# EAGLE design NMEA-v8.3-iso (EAGLE 6.4)
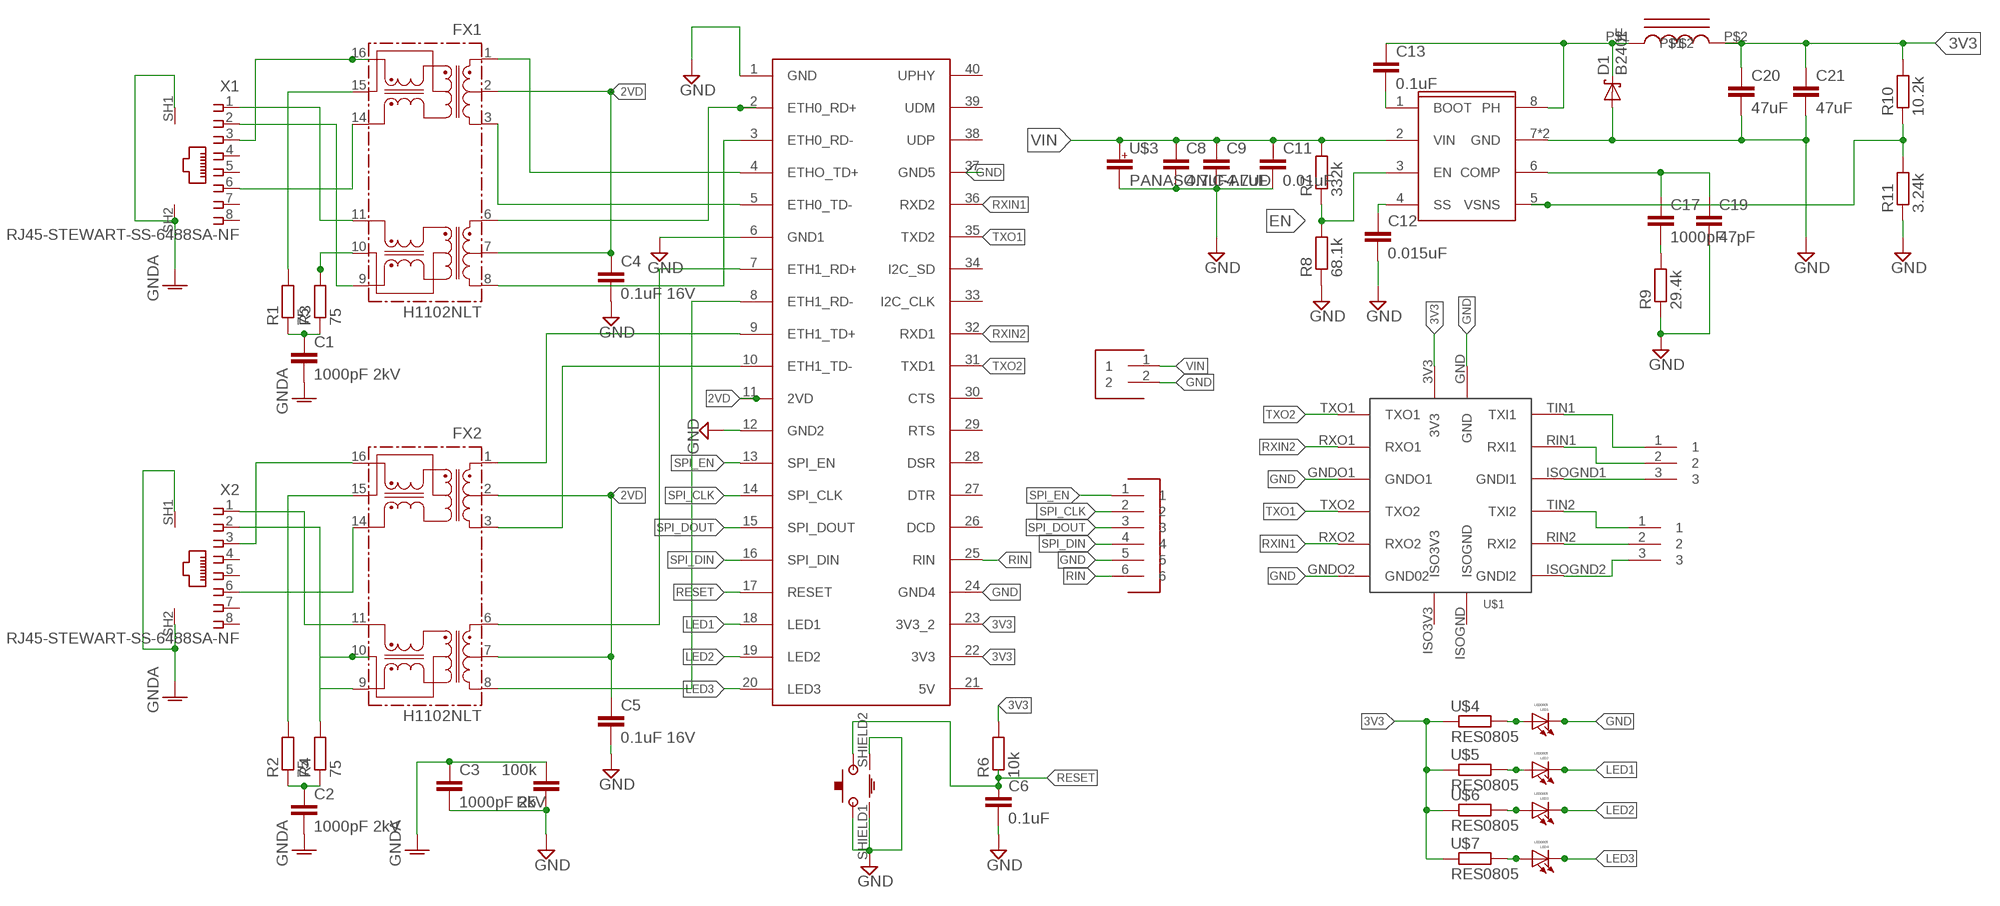
[diagram p0: schematic, sheet 1]

## Parts
C1  1000pF 2kV  CAP1206  [1206]
C2  1000pF 2kV  CAP1206  [1206]
C3  1000pF 2kV  CAP1206  [1206]
C4  0.1uF 16V  CAP0603  [0603]
C5  0.1uF 16V  CAP0603  [0603]
C6  0.1uF  CAP0603  [0603]
C8  4.7uF  CAP1210  [1210]
C9  4.7uF  CAP1210  [1210]
C11  0.01uF  CAP0603  [0603]
C12  0.015uF  CAP0603  [0603]
C13  0.1uF  CAP0603  [0603]
C17  1000pF  CAP0603  [0603]
C19  47pF  CAP0603  [0603]
C20  47uF  CAP1206  [1206]
C21  47uF  CAP1206  [1206]
CARAMBOLA  CARAMBOLACREAM  [CARAMBOLA-CREAM]
D1  B240F  [SMB]
DATA1  CON-3CREAM  [CON-3-CREAM]
DATA2  CON-3CREAM  [CON-3-CREAM]
FX1  H1102NLT  [H/HX1XXXNL]
FX2  H1102NLT  [H/HX1XXXNL]
J1  CON-5MM-2  [CON--5MM-2]
L1  CLF_TDK_INDUCTORCLF10040  [CLF10040]
LED1  LED0805  [L0805]
LED2  LED0805  [L0805]
LED3  LED0805  [L0805]
LED4  LED0805  [L0805]
R1  75  RES0603  [0603]
R2  75  RES0603  [0603]
R3  75  RES0603  [0603]
R4  75  RES0603  [0603]
R5  100k  CAP1206  [1206]
R6  10k  RES0603  [0603]
R7  332k  RES0603  [0603]
R8  68.1k  RES0603  [0603]
R9  29.4k  RES0603  [0603]
R10  10.2k  RES0603  [0603]
R11  3.24k  RES0603  [0603]
U8  TPS54231  [SOIC-THERMAL]
U$1  ISO-BOARDV1  [ISO-BOARD]
U$2  TACTILE-SWITCH-FSMRA1J  [TACTILE-SWITCH-FSMRA1J]
U$3  PANASONIC-ALUD  [PANASONIC_D]
U$4  RES0805  RES0603  [0603]
U$5  RES0805  RES0603  [0603]
U$6  RES0805  RES0603  [0603]
U$7  RES0805  RES0603  [0603]
U$8  CON-6  [CON-6]
X1  RJ45-STEWART-SS-6488SA-NF  [RJ45-STEWART-6488]
X2  RJ45-STEWART-SS-6488SA-NF  [RJ45-STEWART-6488]

## Nets
2VD: C4.1 C5.1 CARAMBOLA.11(2VD) FX1.2 FX1.7 FX2.2 FX2.7
3V3: C20.1 C21.1 CARAMBOLA.22(3V3) CARAMBOLA.23(3V3_2) L1.P$2 R6.2 R10.2 U$1.3V3 U$4.1 U$5.1 U$6.1 U$7.1
EN: R7.1 R8.2 U8.3(EN)
ETH1_RD-: CARAMBOLA.8(ETH1_RD-) FX2.8
GND: C3.2 C4.2 C5.2 C6.2 C8.2 C9.2 C11.2 C12.2 C19.2 C20.2 C21.2 CARAMBOLA.1(GND) CARAMBOLA.6(GND1) CARAMBOLA.12(GND2) CARAMBOLA.24(GND4) CARAMBOLA.37(GND5) D1.A J1.2 LED1.C R5.1 R8.1 R9.1 R11.1 U8.7(GND) U8.P$1(GND) U$1.GND U$1.GNDO1 U$1.GNDO2(GND02) U$2.2 U$2.SHIELD1 U$2.SHIELD2 U$3.- U$8.5
GNDA: C1.2 C2.2 C3.1 R5.2 X1.SH1 X1.SH2 X2.SH1 X2.SH2
ISOGND1: DATA1.3 U$1.ISOGND1(GNDI1)
ISOGND2: DATA2.3 U$1.ISOGND2(GNDI2)
LED1: CARAMBOLA.18(LED1) LED2.C
LED2: CARAMBOLA.19(LED2) LED3.C
LED3: CARAMBOLA.20(LED3) LED4.C
N$1: CARAMBOLA.4(ETHO_TD+) FX1.1
N$2: C13.2 U8.1(BOOT)
N$3: LED1.A U$4.2
N$4: LED2.A U$5.2
N$5: LED3.A U$6.2
N$6: R10.1 R11.2 U8.5(VSNS)
N$7: C17.1 C19.1 U8.6(COMP)
N$8: C17.2 R9.2
N$9: LED4.A U$7.2
N$11: CARAMBOLA.2(ETH0_RD+) FX1.6
N$13: CARAMBOLA.5(ETH0_TD-) FX1.3
N$16: CARAMBOLA.3(ETH0_RD-) FX1.8
N$17: C2.1 R2.1 R4.1
N$20: FX1.10 R3.2
N$21: FX1.15 R1.2
N$22: C1.1 R1.1 R3.1
N$23: FX1.11 X1.1
N$24: FX1.9 X1.2
N$25: FX1.16 X1.3
N$26: FX1.14 X1.6
N$27: CARAMBOLA.7(ETH1_RD+) FX2.6
N$28: CARAMBOLA.9(ETH1_TD+) FX2.1
N$30: CARAMBOLA.10(ETH1_TD-) FX2.3
N$31: FX2.15 R2.2
N$32: FX2.10 R4.2
N$33: FX2.16 X2.3
N$34: FX2.11 X2.1
N$35: FX2.14 X2.6
N$36: FX2.9 X2.2
PH: C13.1 D1.C L1.P$1 U8.8(PH)
RESET: C6.1 CARAMBOLA.17(RESET) R6.1 U$2.1
RIN: CARAMBOLA.25(RIN) U$8.6
RIN1: DATA1.2 U$1.RIN1(RXI1)
RIN2: DATA2.2 U$1.RIN2(RXI2)
RXIN1: CARAMBOLA.36(RXD2) U$1.RXO2
RXIN2: CARAMBOLA.32(RXD1) U$1.RXO1
SPI_CLK: CARAMBOLA.14(SPI_CLK) U$8.2
SPI_DIN: CARAMBOLA.16(SPI_DIN) U$8.4
SPI_DOUT: CARAMBOLA.15(SPI_DOUT) U$8.3
SPI_EN: CARAMBOLA.13(SPI_EN) U$8.1
SS: C12.1 U8.4(SS)
TIN1: DATA1.1 U$1.TIN1(TXI1)
TIN2: DATA2.1 U$1.TIN2(TXI2)
TXO1: CARAMBOLA.35(TXD2) U$1.TXO2
TXO2: CARAMBOLA.31(TXD1) U$1.TXO1
VIN: C8.1 C9.1 C11.1 J1.1 R7.2 U8.2(VIN) U$3.+
Unconnected: CARAMBOLA.21(5V) CARAMBOLA.26(DCD) CARAMBOLA.27(DTR) CARAMBOLA.28(DSR) CARAMBOLA.29(RTS) CARAMBOLA.30(CTS) CARAMBOLA.33(I2C_CLK) CARAMBOLA.34(I2C_SD) CARAMBOLA.38(UDP) CARAMBOLA.39(UDM) CARAMBOLA.40(UPHY) U$1.ISO3V3 U$1.ISOGND X1.4 X1.5 X1.7 X1.8 X2.4 X2.5 X2.7 X2.8

## Library data of the parts
C1-C6 C8 C9 C11-C13 C17 C19-C21 R5 = __bo_caps:CAP
CARAMBOLA = __my:CARAMBOLA
D1 = __my:B240
DATA1 DATA2 = __my:CON-3
FX1 FX2 = __my:H1102NLT
J1 = __my:CON-5MM-2
L1 = __my:CLF_TDK_INDUCTOR
LED1-LED4 = __my:LED: High Luminous Efficacy 3W Warm White LED Emitter Source: http://www.ledengin.com/products/3wLZ/LZ1-00WW03.pdf
R1-R4 R6-R11 U$4-U$7 = __bo_caps:RES
U8 = __my:TPS54231
U$1 = __my:ISO-BOARD
U$2 = __my:TACTILE-SWITCH-FSMRA
U$3 = __bo_caps:PANASONIC-ALU
U$8 = __my:CON-6
X1 X2 = __my:RJ45-STEWART-SS-6488S

## Board
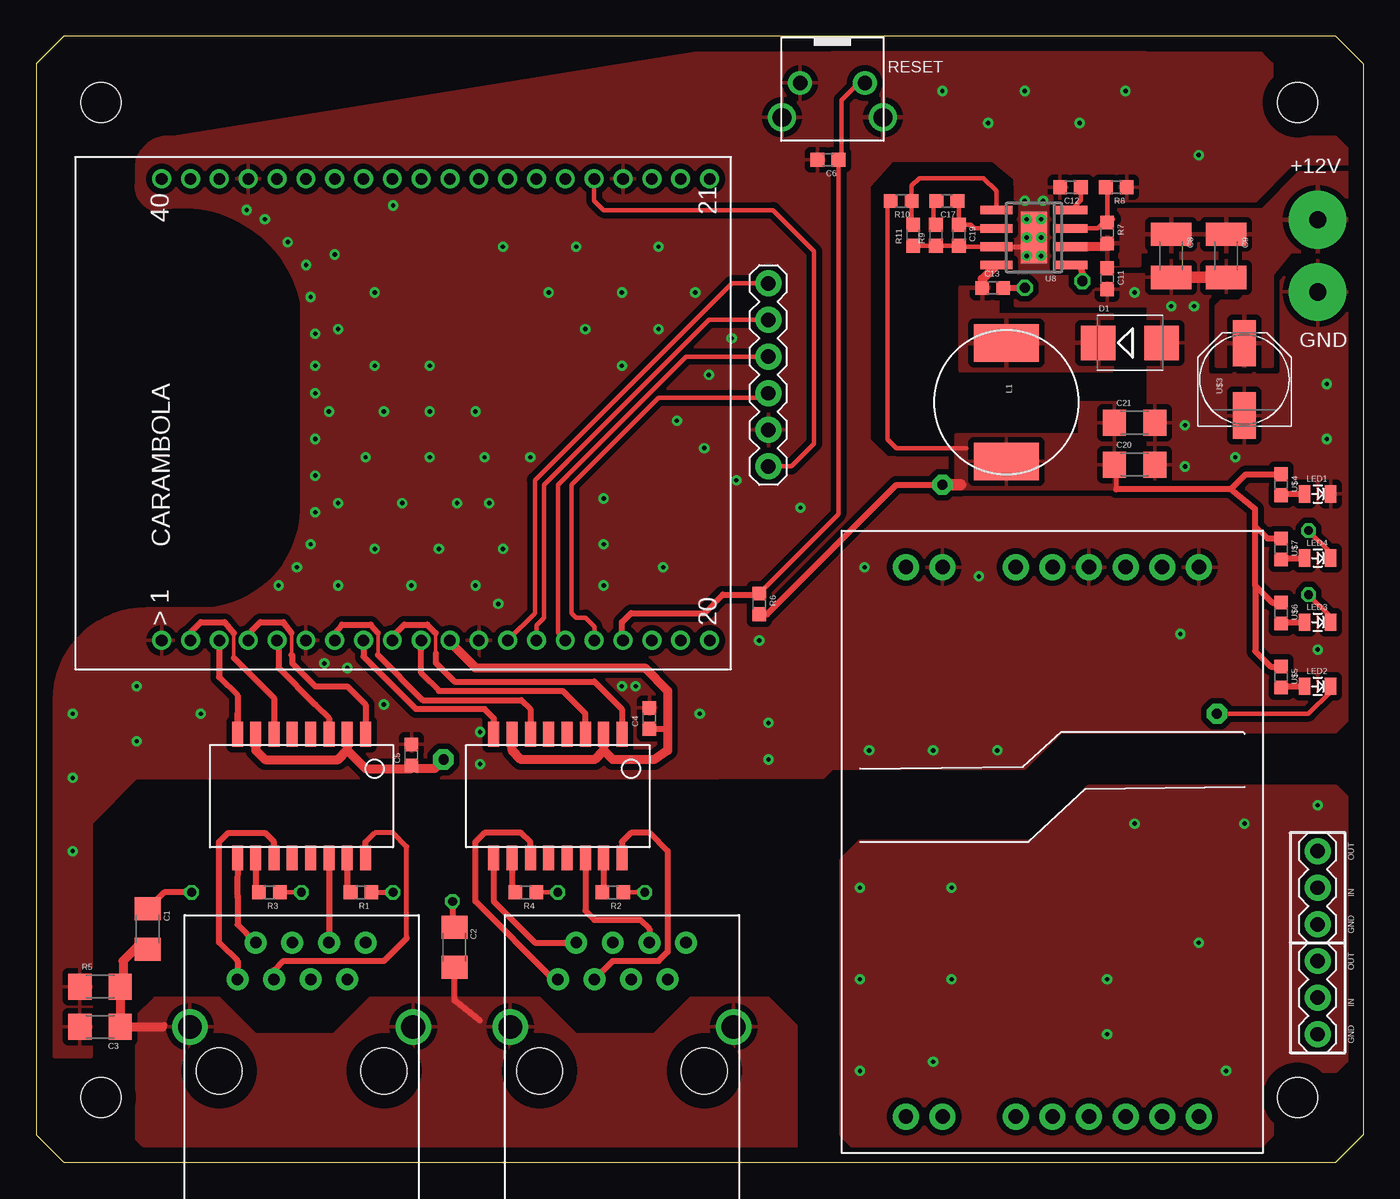
[diagram p1: board, top side]
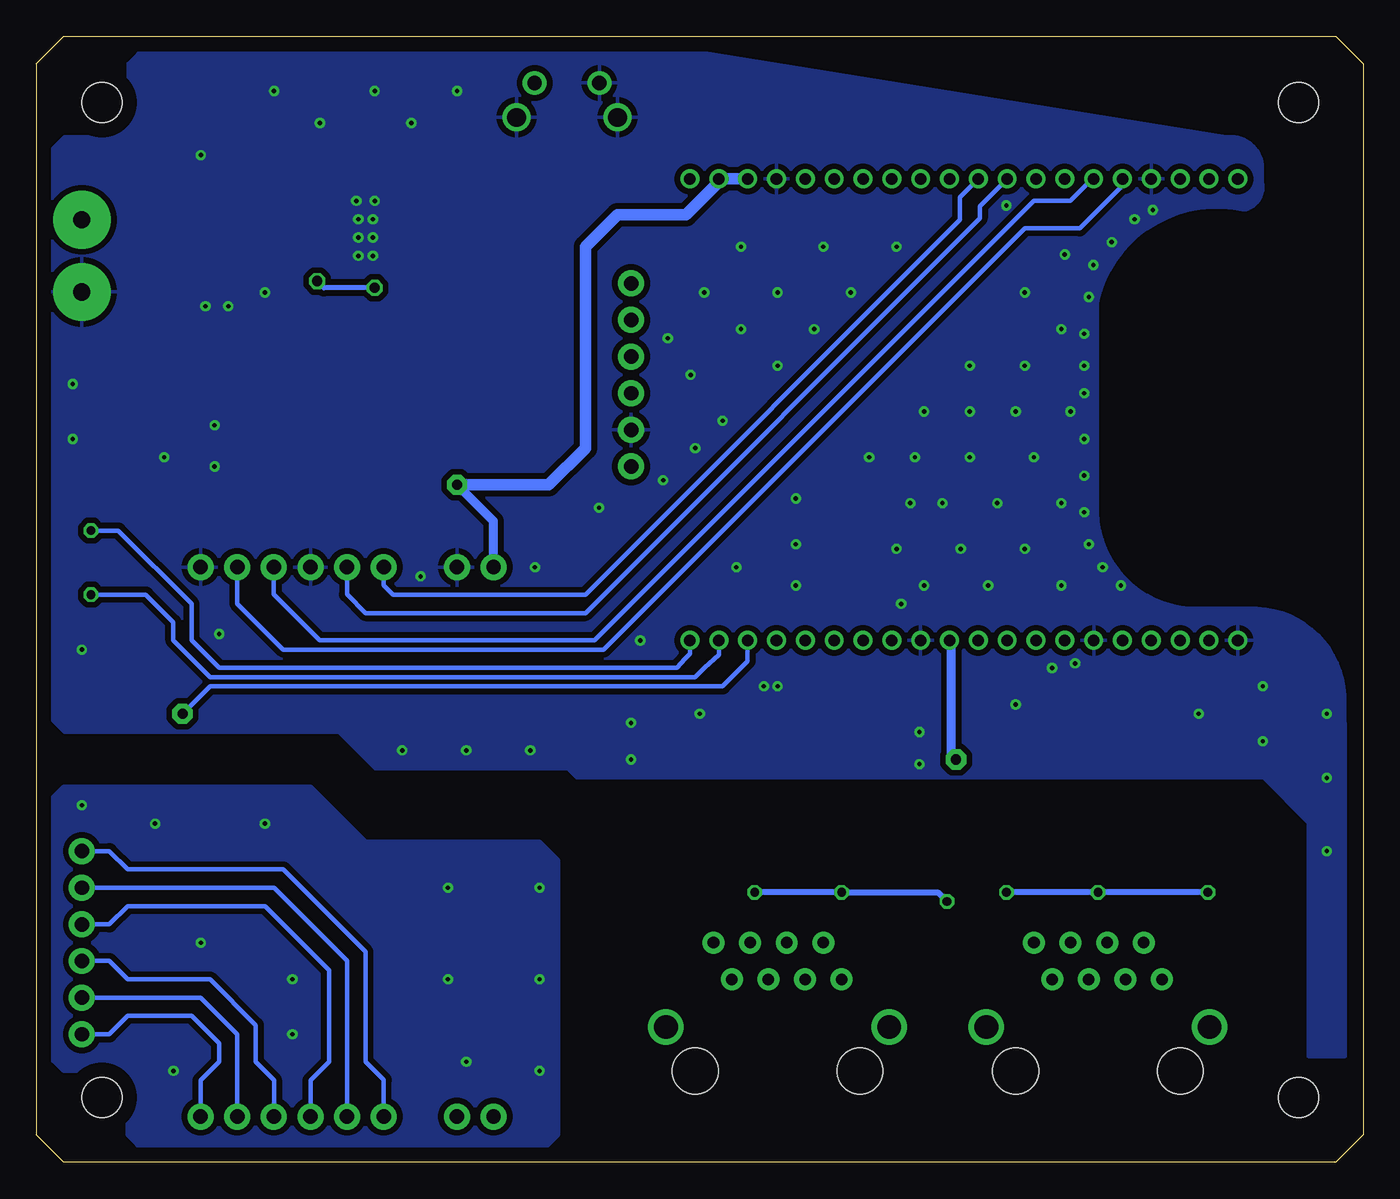
[diagram p2: board, bottom side, seen from below]

Size 92.08 x 78.11 mm. Coordinates in mm from the lower left corner, seen from the top.
Outline: 0,76.2 0,1.91 1.91,0 90.17,0 92.08,1.91 92.08,76.2 90.17,78.11 1.91,78.11 0,76.2
Copper layers (1*16): Top 0.035mm / dielectric 1.5mm / Bottom 0.035mm
Design rules "default *": minimum track width 8mil, minimum drill 10mil, track to track 8mil, track to pad 8mil, pad to pad 8mil, via to via 8mil, smd to smd 8mil, copper to edge 40mil, drill to drill 8mil, minimum pad ring 10mil, minimum via ring 8mil, stop-mask expansion 4mil, vias tented up to drill 0.35mm, thermal gap 16mil
Holes 2.8 mm at 4.5,73.5 87.5,73.5 87.5,4.5 4.5,4.5

### Footprints (pad centres in the part's own frame; a part is rotated, then mirrored left to right if it is on the bottom)
1206 = smd 1.6 x 1.8: 1 -1.4,0.127; 2 1.4,0.127
0603 = smd 0.95 x 0.95: 1 -0.725,0; 2 0.725,0
1210 = smd 1.6 x 2.8: 1 -1.5,0; 2 1.5,0
CARAMBOLA-CREAM = drill 0.8: 1 -16,19; 2 -16,17; 3 -16,15; 4 -16,13; 5 -16,11; 6 -16,9; 7 -16,7; 8 -16,5; 9 -16,3; 10 -16,1; 11 -16,-1; 12 -16,-3; 13 -16,-5; 14 -16,-7; 15 -16,-9; 16 -16,-11; 17 -16,-13; 18 -16,-15; 19 -16,-17; 20 -16,-19; 21 16,-19; 22 16,-17; 23 16,-15; 24 16,-13; 25 16,-11; 26 16,-9; 27 16,-7; 28 16,-5; 29 16,-3; 30 16,-1; 31 16,1; 32 16,3; 33 16,5; 34 16,7; 35 16,9; 36 16,11; 37 16,13; 38 16,15; 39 16,17; 40 16,19
SMB = smd 2.4 x 2.4: A 2.2,0; C -2.2,0
CON-3-CREAM = drill 1 pad 1.8: 1 0,2.54; 2 0,0; 3 0,-2.54
H/HX1XXXNL = smd 0.762 x 1.714: 1 -5.08,-4.286; 2 -3.81,-4.286; 3 -2.54,-4.286; 4 -1.27,-4.286; 5 0,-4.286; 6 1.27,-4.286; 7 2.54,-4.286; 8 3.81,-4.286; 9 3.81,4.286; 10 2.54,4.286; 11 1.27,4.286; 12 0,4.286; 13 -1.27,4.286; 14 -2.54,4.286; 15 -3.81,4.286; 16 -5.08,4.286
CON--5MM-2 = drill 1.2 pad 4: 1 0,2.5; 2 0,-2.5
CLF10040 = smd 2.6 x 4.5: P$1 -4.1,0; P$2 4.1,0
L0805 = smd 0.8 x 1.2: A -0.9,0; C 0.9,0
SOIC-THERMAL = smd 0.6 x 2.2: 1 -1.905,-2.6; 2 -0.635,-2.6; 3 0.635,-2.6; 4 1.905,-2.6; 5 1.905,2.6; 6 0.635,2.6; 7 -0.635,2.6; 8 -1.905,2.6 | smd 3.556 x 1.778: P$1 0,0
ISO-BOARD = drill 1 pad 1.8: 3V3 -10.16,19.05; GND -7.62,19.05; GNDO1 2.54,19.05; GNDO2 10.16,19.05; ISO3V3 -10.16,-19.05; ISOGND -7.62,-19.05; ISOGND1 2.54,-19.05; ISOGND2 10.16,-19.05; RIN1 0,-19.05; RIN2 7.62,-19.05; RXO1 0,19.05; RXO2 7.62,19.05; TIN1 -2.54,-19.05; TIN2 5.08,-19.05; TXO1 -2.54,19.05; TXO2 5.08,19.05
TACTILE-SWITCH-FSMRA1J = drill 0.99 pad 1.651: 1 -2.248,-1.194; 2 2.248,-1.194 | drill 1.3: SHIELD1 -3.505,1.194; SHIELD2 3.505,1.194
PANASONIC_D = smd 3.2 x 1.6: + 2.5,0; - -2.5,0
CON-6 = drill 1 pad 1.8: 1 0,6.35; 2 0,3.81; 3 0,1.27; 4 0,-1.27; 5 0,-3.81; 6 0,-6.35
RJ45-STEWART-6488 = drill 0.8 pad 1.524: 1 -4.445,6.35; 2 -3.175,8.89; 3 -1.905,6.35; 4 -0.635,8.89; 5 0.635,6.35; 6 1.905,8.89; 7 3.175,6.35; 8 4.445,8.89 | drill 1.651: SH1 -7.747,3.048; SH2 7.747,3.048 | hole 3.175: -5.715,0; 5.715,0

### Placement (x,y rotation side)
C1  7.62,16.19 270 top
C2  28.89,14.92 270 top
C3  4.45,9.53 180 top
C4  42.55,30.8 90 top
C5  26.04,28.26 90 top
C6  54.93,69.53 180 top
C8  78.74,62.87 270 top
C9  82.55,62.87 270 top
C11  74.3,61.28 270 top
C12  71.75,67.63 180 top
C13  66.36,60.64 0 top
C17  63.18,66.67 180 top
C19  64.01,64.29 270 top
C20  76.2,48.26 0 top
C21  76.2,51.16 0 top
CARAMBOLA  27.71,52.2 90 top
D1  75.88,56.83 0 top
DATA1  88.9,19.05 0 top
DATA2  88.9,11.43 0 top
FX1  17.78,25.4 180 top
FX2  35.56,25.4 180 top
J1  88.9,62.87 0 top
L1  67.31,52.7 270 top
LED1  88.9,46.35 0 top
LED2  88.9,33.02 0 top
LED3  88.9,37.47 0 top
LED4  88.9,41.91 0 top
R1  22.54,18.73 180 top
R2  40.01,18.73 180 top
R3  16.19,18.73 180 top
R4  33.97,18.73 180 top
R5  4.45,12.06 0 top
R6  50.16,38.73 270 top
R7  74.3,64.45 270 top
R8  74.93,67.63 180 top
R9  62.42,64.29 90 top
R10  60.01,66.67 180 top
R11  60.83,64.29 90 top
U8  69.22,64.14 90 top
U$1  70.5,22.23 0 top
U$2  55.24,73.66 180 top
U$3  83.82,54.29 90 top
U$4  86.36,46.99 270 top
U$5  86.36,33.66 270 top
U$6  86.36,38.1 270 top
U$7  86.36,42.55 270 top
U$8  50.8,54.61 0 top
X1  18.41,6.35 0 top
X2  40.64,6.35 0 top

### Tracks (layer width: path | path; a pad name or v marks a point on that pad's centre or on a via)
2VD  (via drill 0.7 pad 1.4)
  Top 0.356: FX2.7 33.02,29.21
  Top 0.406: C4.1 43.59,30.07 43.81,29.84
  Top 0.61: v28.26,27.94 27.62,27.3 26.4,27.3 C5.1 26.04,27.3 22.86,27.3 21.59,28.57 | FX1.7 15.24,28.57 15.88,27.94 20.95,27.94 21.59,28.57 | FX1.2 21.59,28.57 | CARAMBOLA.11 28.71,36.05 30.48,34.29 42.23,34.29 43.81,32.7 43.81,29.84 43.81,28.57 42.86,27.94 40.01,27.94 39.37,28.57 | FX2.7 33.02,28.57 33.66,27.94 38.73,27.94 39.37,28.57 | FX2.2 39.37,28.57
  Bottom 0.61: v28.26,27.94 28.57,28.26 28.57,36.06 CARAMBOLA.11
3V3  (via drill 0.7 pad 1.4)
  Top 0.254: L1.P$2 67.31,49.53
  Top 0.305: 64.53,49.53 59.69,49.53 59.05,50.16 59.05,66.67 58.97,66.9 R10.2 | 74.93,46.67 74.93,48.26 C20.1
  Top 0.406: 82.87,46.67 74.93,46.67 | 84.56,40.01 85.74,38.83 U$6.1 | 84.56,40.01 84.56,35.45 85.64,34.38 U$5.1 | 82.87,46.67 84.56,45.3 84.56,44.13 | 84.56,40.01 84.56,44.13 | 82.87,46.67 83.91,47.72 U$4.1 | U$7.1 85.42,43.27 84.56,44.13 | R6.2 50.71,38.01 59.69,46.99 v62.87,46.99
  Top 0.813: 64.14,46.99 v62.87,46.99
  Bottom 0.61: U$1.3V3 60.34,44.47 v62.87,46.99
  Bottom 0.813: CARAMBOLA.23 CARAMBOLA.22 44.72,68 46.99,65.72 51.75,65.72 53.98,63.5 53.98,49.53 56.52,46.99 v62.87,46.99
  pour Top (isolate 0.406): 74.93,46.67 63.82,46.67 63.82,50.48 72.39,50.48 72.39,52.7 74.93,52.7
EN
  Top 0.305: R8.2 74.3,67.22 R7.1 74.7,65.41 74.3,65.41 73.66,64.77 U8.3
ETH1_RD-
  Top 0.406: FX2.8 31.75,30.8 31.11,31.43 26.35,31.43 22.71,35.07 CARAMBOLA.8
GND  (via drill 0.3)
  Top 0.305: U8.7 64.08,63.5 C19.2 R9.1 R11.1
  Top 0.356: U8.7 69.22,63.5 U8.P$1
  Top 0.813: C8.2 C9.2
  other vias: 89.53,50.16 53.02,45.4 6.99,29.21 22.86,48.9 50.8,27.94 11.43,31.11 50.16,36.2 79.38,36.64 57.47,41.27 57.78,28.57 24.13,31.75 20,34.61 62.87,74.3 68.58,74.3 75.56,74.3 79.69,51.12 89.53,53.98 83.19,48.9 27.3,48.9 31.11,48.9 34.29,48.9 25.4,45.72 29.21,45.72 31.43,45.72 39.37,46.04 24.13,52.07 27.3,52.07 27.3,55.24 23.5,55.24 23.5,60.33 20.95,57.78 20.32,52.07 20.95,45.72 23.5,42.55 27.94,42.55 32.38,42.55 39.37,42.86 35.56,60.33 40.64,60.33 45.72,60.33 38.1,57.78 43.18,57.78 48.26,57.15 32.38,63.5 37.47,63.5 43.18,63.5 68.71,65.41 69.72,65.41 68.71,64.14 68.71,62.87 69.72,64.14 69.72,62.87 30.48,52.07 40.64,55.24 46.67,54.61 44.45,51.44 48.58,47.31 46.35,49.53 20.95,40.01 26.04,40.01 30.48,40.01 32.07,38.73 39.37,40.01 43.5,41.27 2.54,21.59 6.99,33.02 2.54,31.11 79.69,48.26 65.41,40.64 66.67,28.57 20.72,62.96 24.77,66.36 62.23,28.57 88.9,35.56 30.8,29.84 46.04,31.11 41.59,33.02 80.64,69.85 66.04,72.07 72.39,72.07 78.74,59.37 50.8,30.48 2.54,26.67 30.8,27.62 21.59,34.29 40.64,33.02 76.2,60.33 80.33,59.37 68.58,66.67 69.85,66.67 19.37,53.34 19.37,50.16 19.37,47.62 19.37,45.09 19.05,42.86 18.1,41.27 16.83,40.01 19.37,55.24 19.37,57.47 19.05,60.01 18.73,62.23 17.46,63.82 15.88,65.41 14.61,66.04
  pour Top (isolate 0.406): 70.04,67.78 70.04,69.85 74.93,69.85 76.83,71.75 76.83,77.47 55.24,77.47 56.52,66.36 59.37,69.53 66.36,69.53 67.94,68.26 67.94,67.78
  pour Top (isolate 0.406, rank 2): 67.94,77.47 84.45,77.47 85.72,76.2 85.72,72.39 87,71.12 90.17,71.12 91.44,69.85 91.44,44.22 77.15,44.22 77.15,59.37 67.94,59.37
  pour Top (isolate 0.406): 4.45,34.92 4.45,26.67 47.31,26.67 50.16,34.92
  pour Bottom (isolate 0.406): 1.27,26.67 1.27,32.38 arc-90 7.94,38.42 11.43,38.42 arc90 18.41,45.09 18.41,59.69 arc90 8.26,66.04 arc-90 6.99,67.94 6.99,69.22 arc-90 9.53,71.12 48.9,77.47 84.45,77.47 85.72,76.2 85.72,72.39 87,71.12 90.17,71.12 92.08,69.22 92.08,31.75 90.17,29.84 71.12,29.84 68.58,27.3 55.24,27.3 54.61,26.67
  pour Bottom (isolate 0.61): 1.27,30.48 1.27,7.3 3.81,7.3 3.81,23.5 6.99,26.67 9.21,28.57 8.26,30.48
  pour Top (isolate 0.406, rank 2): 9.53,71.12 48.9,77.47 57.78,77.47 57.78,50.16 59.05,48.9 64.77,48.9 65.09,27.3 55.24,27.3 54.61,26.67 12.38,26.67 9.21,28.57 6.99,26.67 3.81,23.5 3.81,7.3 1.27,7.3 1.27,32.07 arc-90 7.62,38.42 11.75,38.42 arc90 18.41,45.72 18.41,59.69 arc90 8.26,66.04 arc-90 6.99,67.94 6.99,69.22 arc-90
  pour Top (isolate 0.406, rank 2): 91.44,46.16 91.44,31.11 90.17,29.84 71.12,29.84 68.58,27.3 55.24,27.3 53.98,28.57 53.98,46.16
  pour Top (isolate 0.406, no thermals): 67.94,66.99 67.94,60.96 70.48,60.96 70.48,66.99
GNDA
  Top 0.406: 30.8,9.84 29.02,11.24 C2.2 | C1.2 7.17,15.05 7.11,15.05 | 8.76,9.4 8.89,9.53 | 6.03,12.38 R5.2
  Top 0.61: R5.2 C3.1 8.76,9.4 | 7.11,15.05 6.03,13.97 6.03,12.38
  pour Top (isolate 0.406, rank 3): 8.26,11.43 12.7,11.43 15.24,8.89 20.64,8.89 23.18,11.43 34.92,11.43 37.47,8.89 42.86,8.89 45.4,11.43 50.8,11.43 52.7,9.53 52.7,0.64 8.26,0.64 7.3,1.27 6.99,1.59 6.99,10.16
ISOGND  (via drill 0.3)
  other vias: 57.15,19.05 63.5,19.05 88.9,24.77 63.5,12.7 57.15,12.7 57.15,6.35 62.23,6.99 74.3,8.89 74.3,12.7 80.64,15.24 83.82,23.5 76.2,23.5 82.55,6.35
  pour Top (isolate 0.406): 55.88,20.95 57.15,22.23 69.22,22.23 73.03,26.04 90.17,26.04 91.44,24.77 91.44,7.62 90.17,6.35 87,6.35 85.72,5.08 85.72,1.91 84.45,0.64 57.15,0.64 55.88,1.91
  pour Bottom (isolate 0.406): 55.88,1.91 57.15,0.64 84.45,0.64 85.72,1.91 85.72,5.08 87,6.35 90.17,6.35 91.44,7.62 91.44,24.77 90.17,26.04 73.03,26.04 69.22,22.23 57.15,22.23 55.88,20.95
ISOGND1
  Bottom 0.305: DATA1.3 87,16.51 85.72,17.78 76.2,17.78 71.75,13.34 71.75,6.99 73.04,5.7 U$1.ISOGND1
ISOGND2
  Bottom 0.305: DATA2.3 87,8.89 85.72,10.16 81.28,10.16 79.38,8.26 79.38,6.99 80.66,5.7 U$1.ISOGND2
LED1  (via drill 0.7 pad 1.4)
  Top 0.305: v81.92,31.11 88.27,31.11 89.8,32.65 LED2.C
  Bottom 0.305: v81.92,31.11 80.01,33.02 44.45,33.02 42.72,34.76 CARAMBOLA.18
LED2  (via drill 0.6)
  Top 0.305: 89.8,37.2 LED3.C 89.8,37.84 v88.27,39.37
  Bottom 0.305: CARAMBOLA.19 44.72,35.19 45.72,34.29 46.35,33.66 80.01,33.66 82.55,36.2 82.55,37.47 84.45,39.37 v88.27,39.37
LED3  (via drill 0.6)
  Top 0.305: 89.8,41.65 LED4.C | 89.8,42.28 v88.27,43.81
  Top 0.406: LED4.C 89.8,42.28
  Bottom 0.305: CARAMBOLA.20 46.72,35.28 47.08,34.92 47.62,34.29 79.38,34.29 81.28,36.2 81.28,38.73 86.36,43.81 v88.27,43.81
N$1
  Top 0.254: 17.71,36.7 17.71,35.2
  Top 0.406: CARAMBOLA.4 14.92,36.83 15.56,37.47 17.14,37.47 17.71,36.7 | FX1.1 22.86,31.75 21.59,33.02 19.37,33.02 17.78,34.61 17.78,35.14 17.71,35.2
N$2  (via drill 0.7)
  Top 0.305: 72.39,62.23 U8.1
  Top 0.406: v72.58,61.12 72.58,61.72 72.39,62.23 | C13.2 v68.58,60.64
  Bottom 0.356: v72.58,61.12 72.11,60.64 v68.58,60.64
N$3
  Top 0.406: U$4.2 86.45,46.35 LED1.A
N$4
  Top 0.406: U$5.2 86.58,33.02 LED2.A
N$5
  Top 0.406: U$6.2 86.45,37.47 LED3.A
N$6
  Top 0.305: U8.5 66.61,67.37 65.72,68.26 61.28,68.26 60.73,67.72 R10.1 60.73,65.55 R11.2
N$7
  Top 0.305: C17.1 64.01,66.89 C19.1 64.84,65.02 65.09,64.77 U8.6
N$8
  Top 0.305: R9.2 62.23,65.14 62.23,66.36 62.46,66.58 C17.2
N$9
  Top 0.406: U$7.2 86.45,41.91 LED4.A
N$11
  Top 0.254: 13.71,36.7 13.71,34.99
  Top 0.305: CARAMBOLA.2 10.79,36.2
  Top 0.406: 10.79,36.2 10.79,36.83 11.43,37.47 13.08,37.47 13.71,36.7 | 13.71,34.99 16.51,32.19 FX1.6
N$13
  Top 0.406: FX1.3 20.32,30.8 19.37,31.75 16.83,34.29 16.83,35.68 CARAMBOLA.5
N$16
  Top 0.406: FX1.8 13.97,30.48 | 13.97,30.48 13.97,31.11 | CARAMBOLA.3 12.7,33.66 13.97,32.38 13.97,30.48
N$17  (via drill 0.6)
  Top 0.305: v36.2,18.73 R4.1 | v42.23,18.73 R2.1
  Top 0.406: v28.89,18.1 28.89,16.83 C2.1
  Bottom 0.406: v42.23,18.73 v36.2,18.73 29.53,18.73 v28.89,18.1
N$20
  Top 0.305: 15.24,19.05 15.51,18.78 R3.2
  Top 0.406: FX1.10 15.24,20.11 15.24,19.05
N$21
  Top 0.305: 21.59,19.05 21.86,18.78 R1.2
  Top 0.406: FX1.15 21.59,20.11 21.59,19.05
N$22  (via drill 0.6)
  Top 0.305: R3.1 v18.41,18.73 | v10.79,18.73
  Top 0.356: R1.1 v24.77,18.73
  Top 0.406: v10.79,18.73 8.89,18.73 C1.1
  Bottom 0.406: v24.77,18.73 v18.41,18.73 v10.79,18.73
N$23
  Top 0.406: FX1.11 16.51,22.23 15.88,22.86 13.34,22.86 12.7,22.23 12.7,15.24 13.97,13.97 X1.1
N$24
  Top 0.406: FX1.9 13.96,18.65 13.97,18.41 13.97,16.51 X1.2
N$25
  Top 0.356: 22.86,22.23 23.5,22.86 24.77,22.86 25.72,21.91 25.72,15.56
  Top 0.406: FX1.16 22.86,22.23 | X1.3 16.51,13.34 17.14,13.97 24.13,13.97 25.72,15.56
N$26
  Top 0.406: FX1.14 X1.6
N$27
  Top 0.254: 23.71,36.7 23.71,35.18
  Top 0.406: FX2.6 34.29,31.43 33.66,32.07 26.83,32.07 23.71,35.18 | CARAMBOLA.7 20.71,36.7 21.21,37.29 23.21,37.29 23.71,36.7
N$28
  Top 0.254: 27.71,36.7 27.71,35.29
  Top 0.406: CARAMBOLA.9 24.77,36.51 25.54,37.29 27.13,37.29 27.71,36.7 | FX2.1 40.64,31.43 38.73,33.34 29.03,33.34 27.71,34.65 27.71,35.29
N$30
  Top 0.406: FX2.3 38.1,31.11 36.51,32.7 27.94,32.7 26.71,33.93 CARAMBOLA.10
N$31
  Top 0.406: FX2.15 39.37,19 R2.2
N$32
  Top 0.406: FX2.10 33.02,19 R4.2
N$33
  Top 0.406: FX2.16 40.64,22.23 41.27,22.86 42.55,22.86 43.81,21.59 43.81,14.61 43.18,13.97 40.01,13.97 X2.3
N$34
  Top 0.406: FX2.11 34.29,22.23 33.66,22.86 31.11,22.86 30.48,22.23 30.48,18.1 35.88,12.7 X2.1
N$35
  Top 0.406: FX2.14 38.1,17.46 38.73,16.83 41.91,16.83 42.55,16.19 X2.6
N$36
  Top 0.406: FX2.9 31.75,18.1 34.61,15.24 X2.2
PH
  Top 0.305: 67.59,56.52 L1.P$1
  Top 0.61: U8.8 65.63,61.25 C13.1
  pour Top (isolate 0.406): 66.67,60.64 66.67,58.74 74.61,58.74 74.61,54.93 64.14,54.93 64.14,60.64
RESET
  Top 0.305: U$2.1 57.07,74.85 55.88,73.66 55.88,69.76 | C6.1 55.65,44.95 R6.1
  Top 0.406: CARAMBOLA.17 40.64,36.28 40.64,37.47 41.27,38.1 46.35,38.1 47.62,39.37 50.08,39.37 R6.1 | 55.88,69.76 C6.1
RIN
  Top 0.305: CARAMBOLA.25 38.72,66.69 39.37,66.04 51.12,66.04 53.98,63.18 53.98,49.85 52.39,48.26 U$8.6
RIN1
  Bottom 0.305: DATA1.2 75.56,19.05 70.5,13.98 U$1.RIN1
RIN2
  Bottom 0.305: U$1.RIN2 78.12,8.9 80.64,11.43 DATA2.2
RXIN1
  Bottom 0.305: U$1.RXO2 78.12,38.75 74.93,35.56 52.7,35.56 23.5,64.77 19.68,64.77 16.71,67.74 CARAMBOLA.36
RXIN2
  Bottom 0.305: U$1.RXO1 70.5,39.38 69.22,38.1 53.98,38.1 26.62,65.45 26.62,66.3 CARAMBOLA.32
SPI_CLK
  Top 0.305: U$8.2 46.67,58.42 35.24,46.99 35.24,37.78 34.72,37.26 CARAMBOLA.14
SPI_DIN
  Top 0.305: U$8.4 50.48,53.02 43.18,53.02 37.15,46.99 37.15,38.1 37.47,37.78 38.1,37.78 38.73,37.15 38.73,36.23 CARAMBOLA.16
SPI_DOUT
  Top 0.305: U$8.3 45.09,55.88 36.2,46.99 36.2,36.73 CARAMBOLA.15
SPI_EN
  Top 0.305: U$8.1 48.26,60.96 34.61,47.31 34.61,38.1 CARAMBOLA.13
SS
  Top 0.305: U8.4 72.48,66.7 C12.1
TIN1
  Bottom 0.305: DATA1.1 87,21.59 85.72,20.32 74.93,20.32 69.22,14.61 69.22,6.99 67.96,5.73 U$1.TIN1
TIN2
  Bottom 0.305: DATA2.1 87,13.97 85.72,12.7 80.01,12.7 76.83,9.53 76.83,6.99 75.56,5.71 75.56,3.19 U$1.TIN2
TXO1
  Bottom 0.305: 18.79,68.2 20.32,66.67 22.86,66.67 53.34,36.2 72.39,36.2 75.58,39.38 U$1.TXO2
  Bottom 0.406: CARAMBOLA.35 18.79,68.2
TXO2
  Bottom 0.305: U$1.TXO1 67.96,40.02 67.31,39.37 53.98,39.37 27.98,65.36 27.98,66.94 CARAMBOLA.31
VIN
  Top 0.61: R7.2 74.39,63.5 U8.2
  pour Top (isolate 0.406): 73.98,62.23 73.98,66.04 85.09,66.04 87.63,68.58 91.44,68.58 91.44,63.18 87,63.18 85.72,61.59 85.72,55.24 81.92,55.24 81.92,59.37 82.23,59.69 83.5,59.69 83.82,60.01 83.82,63.18 76.52,63.18 76.52,62.23

### Text on the board
tPlace: RESET | +12V | GND | OUT | IN | GND | OUT | IN | GND
DrillLegend_01-16: 01-16
DrillLegend_01-20: 01-20